# Altium project LED0805-3.PrjPCB
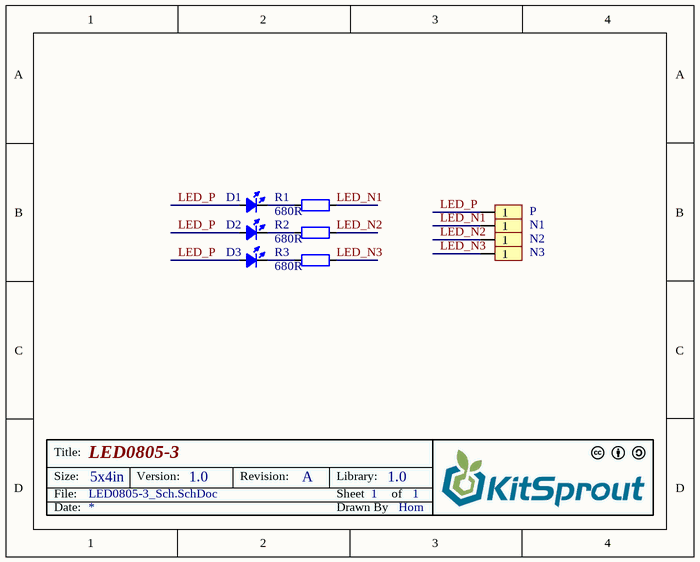
[diagram p0: LED0805-3_Sch.SchDoc]
1 sheet, 10 parts. Net scope: global (net labels, ports and power ports of the same name join across sheets).
Board file: LED0805-3_Pcb.PcbDoc

## Sheet LED0805-3_Sch.SchDoc: LED0805-3
size 127 x 101 mm; Author: Hom; CompanyName: KitSprout; DrawnBy: Hom; Engineer: Hom; Organization: KitSprout; Revision: A; SheetNumber: 1; SheetTotal: 1; License: CC BY-SA 4.0; Version: 1.0; LibVersion: 1.0; PageSetup: Record=PageOptions|CenterHorizontal=True|CenterVertical=True|PrintScale=1.00|XCorrection=1.00|YCorrection=1.00|PrintKind=0|BorderSize=5000000|LeftOffset=0|BottomOffset=0|Orientation=2|PaperLength=1000|PaperWidth=1000|Scale=100|PaperSource=7|PrintQuality=-4|MediaType=1|DitherType=10|PaperKind=A4|PrintScaleMode=0

### Parts
D1  LED_0805  [LED_0805_BLUE]  (value not drawn)
D2  LED_0805  [LED_0805_BLUE]  (value not drawn)
D3  LED_0805  [LED_0805_BLUE]  (value not drawn)
N1  HDR-PAD_2.54  [HDR-PAD_2.54]  (value not drawn)
N2  HDR-PAD_2.54  [HDR-PAD_2.54]  (value not drawn)
N3  HDR-PAD_2.54  [HDR-PAD_2.54]  (value not drawn)
P  HDR-PAD_2.54  [HDR-PAD_2.54]  (value not drawn)
R1  value 680R  [RES_0805]  (hidden comment: Res_0805)
R2  value 680R  [RES_0805]  (hidden comment: Res_0805)
R3  value 680R  [RES_0805]  (hidden comment: Res_0805)

### Nets
LED_N1: N1.1 R1.2
LED_N2: N2.1 R2.2
LED_N3: N3.1 R3.2
LED_P: D1.1(A) D2.1(A) D3.1(A) P.1
NetD1_2: D1.2(K) R1.1
NetD2_2: D2.2(K) R2.1
NetD3_2: D3.2(K) R3.1

### Notes on the sheet
- Title:
- Size:
- Date:
- File:
- 5x4in
- Version:
- Revision:
- Sheet
- Drawn By
- Library:
- of

### Library data of the parts
D1-D3 = LED_0805: LED
N1-N3 P = HDR-PAD_2.54: Header
R1-R3 = Res_0805: Resistor